# Altium schematic sheet Touch.SchDoc
size 209 x 148 mm
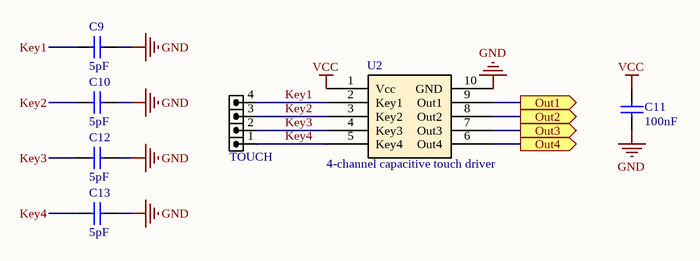
[diagram p0: Touch.SchDoc]

## Parts
C9  5pF  [0603C]
C10  5pF  [0603C]
C11  100nF  [0603C]
C12  5pF  [0603C]
C13  5pF  [0603C]
TOUCH  HDR4  [HDR1SE_M_1X4]  (value not drawn)
U2  4-channel capacitive touch driver  [MSOP-10]

## Ports
Out1 (out), Out2 (out), Out3 (out), Out4 (out)

## Nets
GND: C9.1 C10.1 C11.1 C12.1 C13.1 U2.10(GND)
VCC: C11.2 U2.1(Vcc)
Key1: C9.2 TOUCH.4 U2.2(Key1)
Key2: C10.2 TOUCH.3 U2.3(Key2)
Key3: C12.2 TOUCH.2 U2.4(Key3)
Key4: C13.2 TOUCH.1 U2.5(Key4)
Out1: U2.9(Out1) ; port Out1
Out2: U2.8(Out2) ; port Out2
Out3: U2.7(Out3) ; port Out3
Out4: U2.6(Out4) ; port Out4

## Library data of the parts
C9-C13 = Cap: Capacitor
  C9 C10 C12 C13: Value: 5pF
  C11: Value: 100nF
TOUCH = HDRTST_1X4: HEADER, 1mm pitch, test, SMD; VALUE: HDR4
U2 = BS814A-1